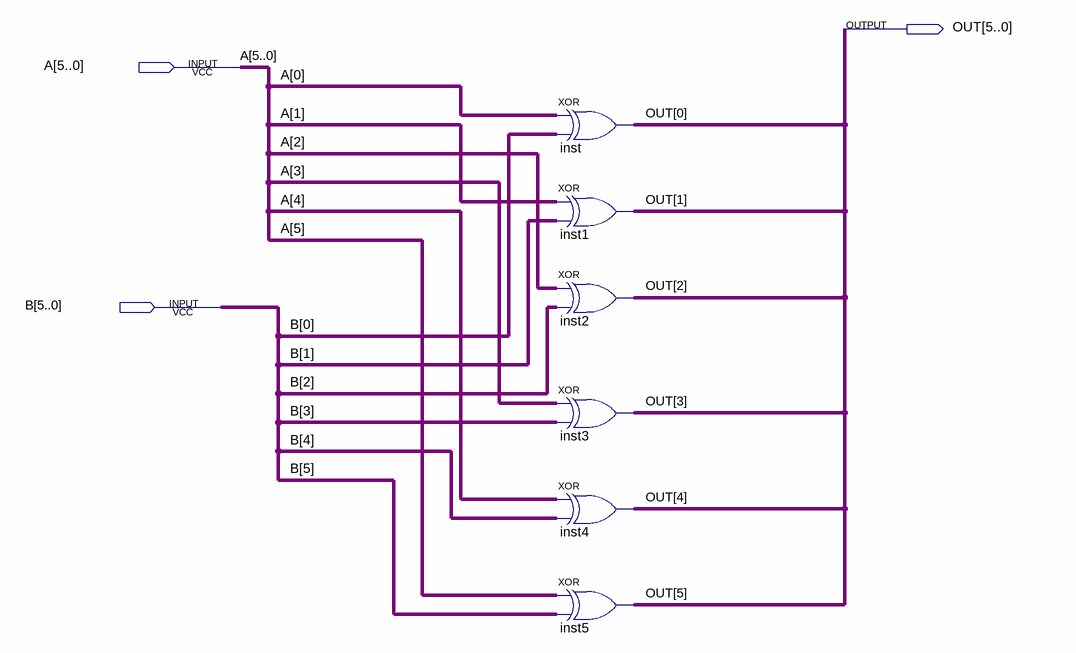
[diagram p0: schematic sheet]
// Quartus schematic opXOR.bdf as structural Verilog: 6 symbols, 3 pins
module opXOR (
  input  [5:0] A,
  input  [5:0] B,
  output [5:0] OUT
);

  xor inst (OUT[0], A[0], B[0]);
  xor inst1 (OUT[1], A[1], B[1]);
  xor inst2 (OUT[2], A[2], B[2]);
  xor inst3 (OUT[3], A[3], B[3]);
  xor inst4 (OUT[4], A[4], B[4]);
  xor inst5 (OUT[5], A[5], B[5]);
endmodule
